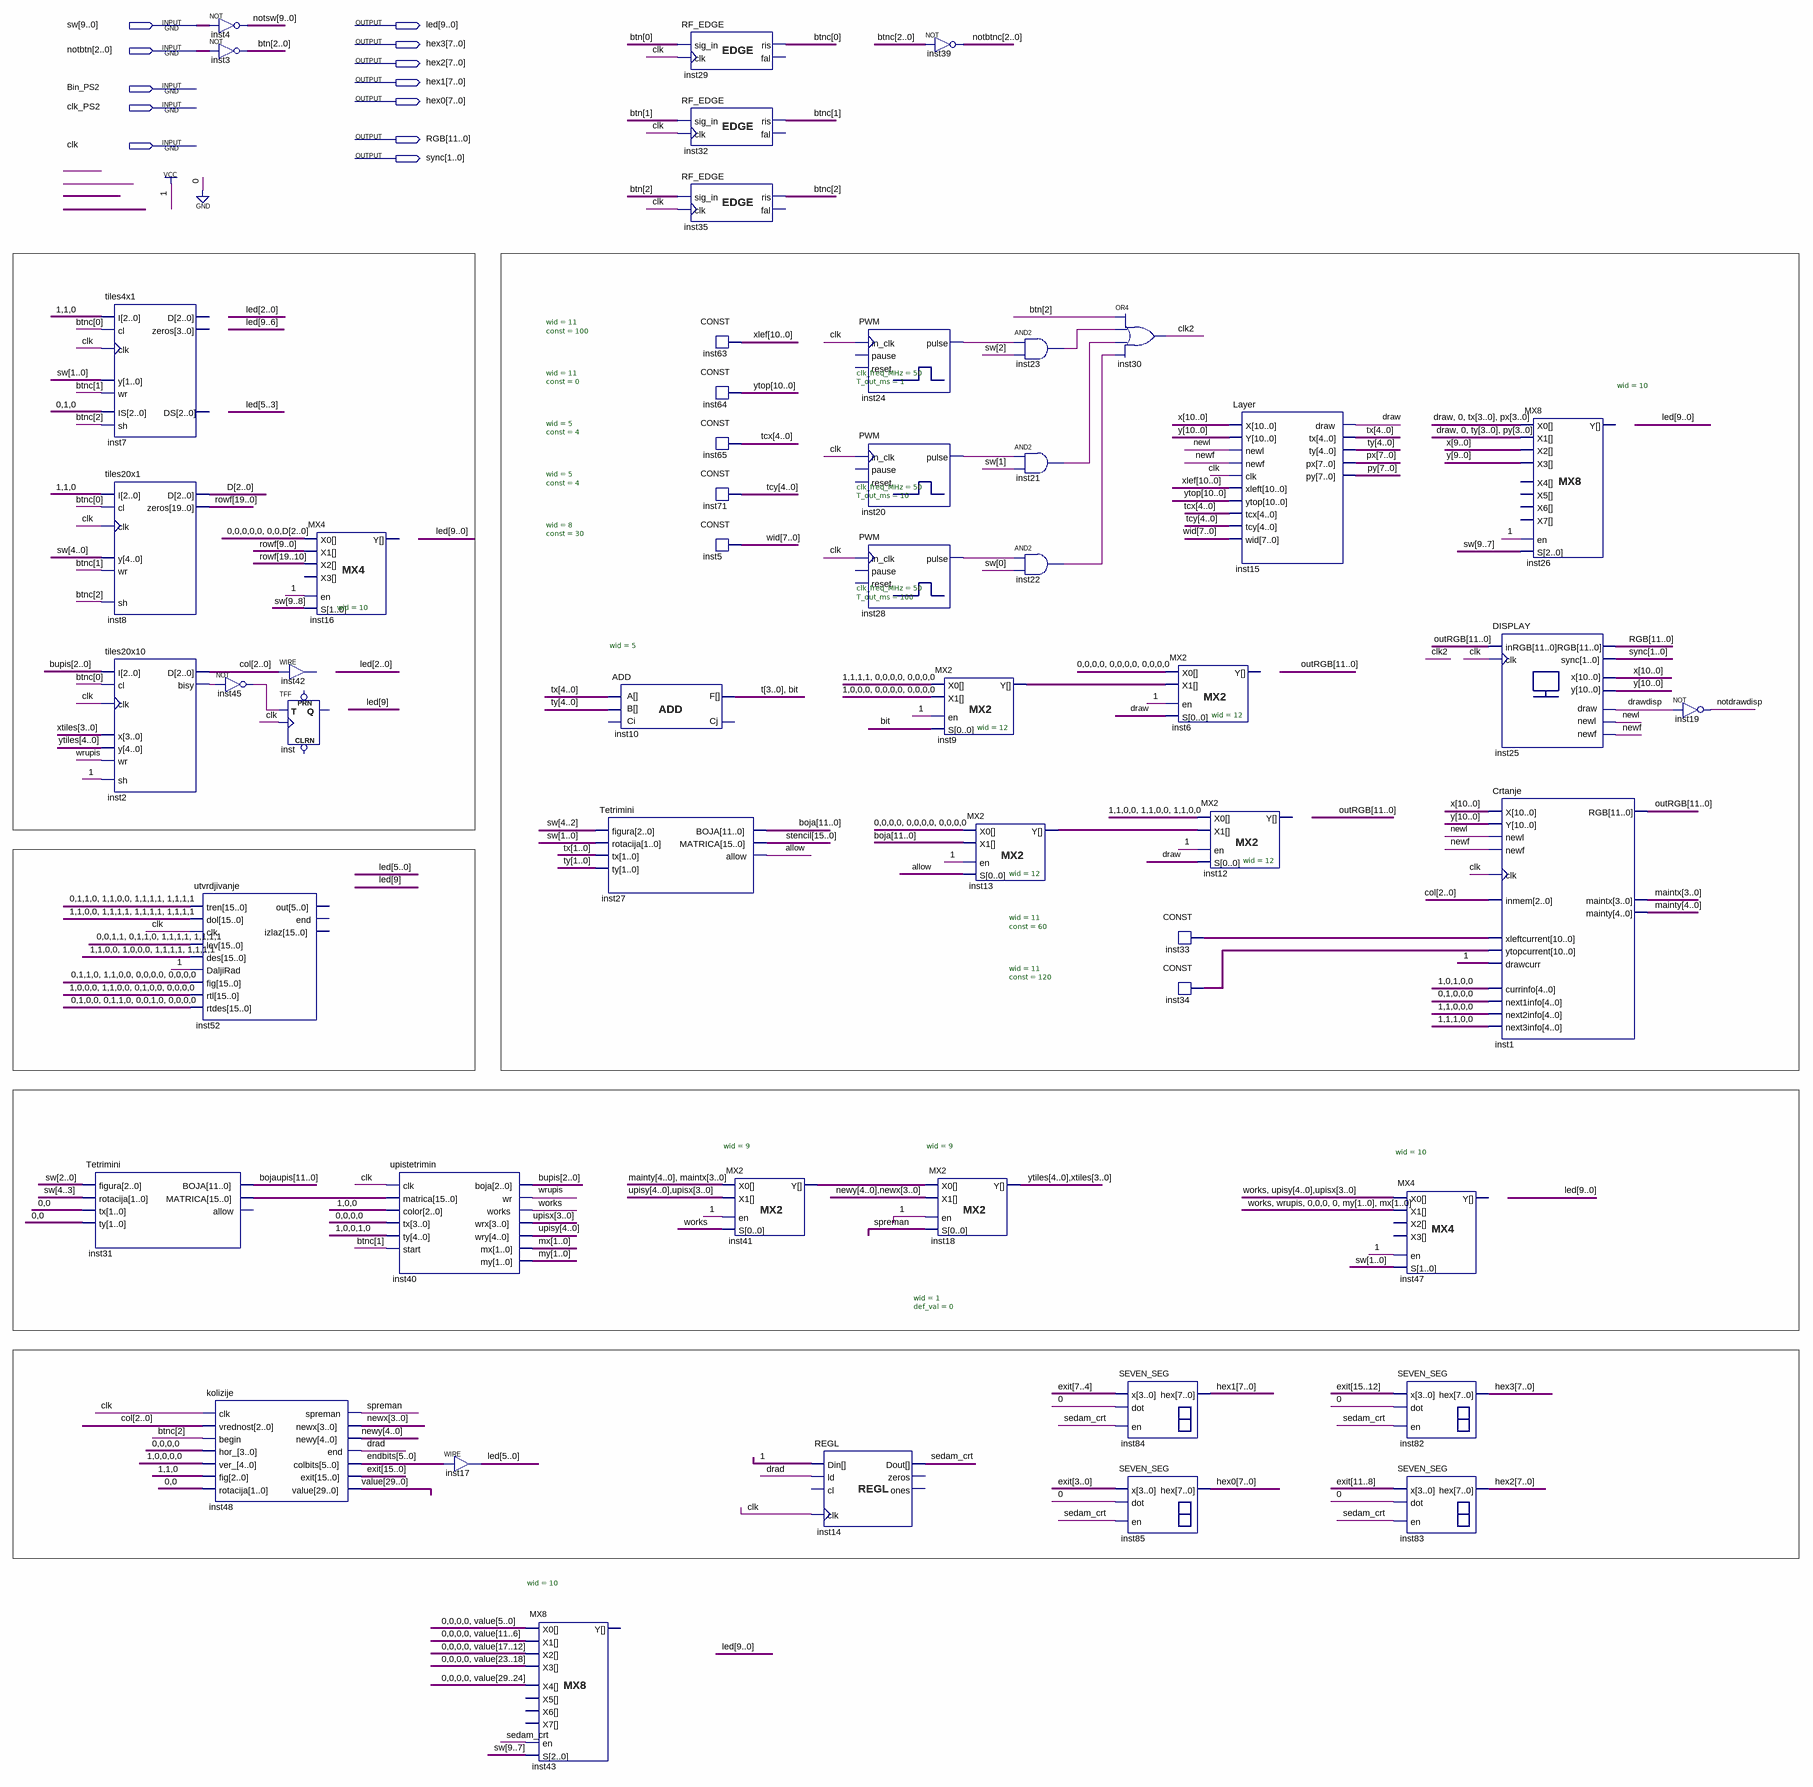
[diagram p0: schematic sheet]
// Quartus schematic test_modules.bdf as structural Verilog: 52 symbols, 12 pins
module test_modules (
  input  [9:0] sw,
  input  [2:0] notbtn,
  input  Bin_PS2,
  input  clk_PS2,
  input  clk,
  output [9:0] led,
  output [7:0] hex3,
  output [7:0] hex2,
  output [7:0] hex1,
  output [7:0] hex0,
  output [11:0] RGB,
  output [1:0] sync
);

  wire allow, \bit , clk2, drad, draw, drawdisp, inst2_bisy, inst20_pulse, inst21_out, inst22_out,
       inst23_out, inst24_pulse, inst28_pulse, inst45_out, newf, newl, notdrawdisp, sedam_crt, spreman,
       works, wrupis;
  wire [1:0] mx, my;
  wire [2:0] btn, btnc, bupis, col, D, notbtnc;
  wire [3:0] maintx, newx, t, upisx, xtiles;
  wire [4:0] mainty, newy, tcx, tcy, tx, ty, upisy, ytiles;
  wire [5:0] endbits;
  wire [7:0] px, py, wid;
  wire [8:0] inst41_y;
  wire [9:0] notsw;
  wire [10:0] inst33_data, inst34_data, x, xlef, y, ytop;
  wire [11:0] boja, bojaupis, inst9_y, inst13_y, outRGB;
  wire [15:0] exit, inst31_matrica, stencil;
  wire [19:0] rowf;
  wire [29:0] value;

  Tetrimini inst31 (
    .figura(sw[2:0]), .rotacija(sw[4:3]), .tx(2'b00), .ty(2'b00), .BOJA(bojaupis), .MATRICA(inst31_matrica));  // open: allow
  tiles4x1 inst7 (
    .I(3'b110), .cl(btnc[0]), .clk(clk), .y(sw[1:0]), .wr(btnc[1]), .IS(3'b010), .sh(btnc[2]));  // open: D, zeros, DS
  tiles20x1 inst8 (.I(3'b110), .cl(btnc[0]), .clk(clk), .y(sw[4:0]), .wr(btnc[1]), .sh(btnc[2]), .D(D), .zeros(rowf));
  tiles20x10 inst2 (
    .I(bupis), .cl(btnc[0]), .clk(clk), .x(xtiles), .y(ytiles), .wr(wrupis), .sh(1'b1), .D(col),
    .bisy(inst2_bisy));
  assign notsw = ~sw;  // NOT inst4, 10 bits wide
  assign btn = ~notbtn;  // NOT inst3, 3 bits wide
  not inst45 (inst45_out, inst2_bisy);
  utvrdjivanje inst52 (
    .tren(16'b0110110011111111), .dol(16'b1100111111111111), .clk(clk), .lev(16'b0011011011111111),
    .des(16'b1100100011111111), .DaljiRad(1'b1), .fig(16'b0110110000000000), .rtl(16'b1000110001000000),
    .rtdes(16'b0100011000100000));  // open: out, end, izlaz
  kolizije inst48 (
    .clk(clk), .vrednost(col), .\begin (btnc[2]), .hor_(4'b0000), .ver_(5'b10000), .fig(3'b110),
    .rotacija(2'b00), .spreman(spreman), .newx(newx), .newy(newy), .\end (drad), .colbits(endbits),
    .exit(exit), .value(value));
  // WIRE inst42 has open pins
  TFF inst (.T(inst45_out), .CLK(clk));  // open: PRN, CLRN, Q
  MX4 #(.wid(10)) inst16 (
    .X0({{7{1'b0}}, D}), .X1(rowf[9:0]), .X2(rowf[19:10]), .en(1'b1), .S(sw[9:8]));  // open: X3, Y
  upistetrimin inst40 (
    .clk(clk), .matrica(inst31_matrica), .color(3'b100), .tx(4'b0000), .ty(5'b10010), .start(btnc[1]),
    .boja(bupis), .wr(wrupis), .works(works), .wrx(upisx), .wry(upisy), .mx(mx), .my(my));
  assign led[5:0] = endbits;  // WIRE inst17
  MX8 #(.wid(10)) inst43 (
    .X0({4'b0000, value[5:0]}), .X1({4'b0000, value[11:6]}), .X2({4'b0000, value[17:12]}),
    .X3({4'b0000, value[23:18]}), .X4({4'b0000, value[29:24]}), .en(sedam_crt), .S(sw[9:7]));  // open: X5, X6, X7, Y
  ADD #(.wid(5)) inst10 (.A(tx), .B(ty), .F({t, \bit }));  // open: Ci, Cj
  Tetrimini inst27 (
    .figura(sw[4:2]), .rotacija(sw[1:0]), .tx(tx[1:0]), .ty(ty[1:0]), .BOJA(boja), .MATRICA(stencil),
    .allow(allow));
  RF_EDGE inst29 (.sig_in(btn[0]), .clk(clk), .ris(btnc[0]));  // open: fal
  RF_EDGE inst32 (.sig_in(btn[1]), .clk(clk), .ris(btnc[1]));  // open: fal
  RF_EDGE inst35 (.sig_in(btn[2]), .clk(clk), .ris(btnc[2]));  // open: fal
  CONST #(.wid(11), .\const (100)) inst63 (.data(xlef));
  CONST #(.wid(11), .\const (0)) inst64 (.data(ytop));
  CONST #(.wid(5), .\const (4)) inst65 (.data(tcx));
  CONST #(.wid(5), .\const (4)) inst71 (.data(tcy));
  CONST #(.wid(8), .\const (30)) inst5 (.data(wid));
  MX2 #(.wid(9)) inst41 (.X0({mainty, maintx}), .X1({upisy, upisx}), .en(1'b1), .S(works), .Y(inst41_y));
  REGL #(.wid(1), .def_val(0)) inst14 (.Din(1'b1), .ld(drad), .clk(clk), .Dout(sedam_crt));  // open: cl, zeros, ones
  PWM #(.clk_freq_MHz(50), .T_out_ms(1)) inst24 (.in_clk(clk), .pulse(inst24_pulse));  // open: pause, reset
  PWM #(.clk_freq_MHz(50), .T_out_ms(10)) inst20 (.in_clk(clk), .pulse(inst20_pulse));  // open: pause, reset
  PWM #(.clk_freq_MHz(50), .T_out_ms(100)) inst28 (.in_clk(clk), .pulse(inst28_pulse));  // open: pause, reset
  assign notbtnc = ~btnc;  // NOT inst39, 3 bits wide
  MX2 #(.wid(12)) inst9 (.X0(12'b111100000000), .X1(12'b100000000000), .en(1'b1), .S(\bit ), .Y(inst9_y));
  MX2 #(.wid(9)) inst18 (.X0(inst41_y), .X1({newy, newx}), .en(1'b1), .S(spreman), .Y({ytiles, xtiles}));
  MX2 #(.wid(12)) inst13 (.X0({12{1'b0}}), .X1(boja), .en(1'b1), .S(allow), .Y(inst13_y));
  and inst23 (inst23_out, inst24_pulse, sw[2]);
  and inst21 (inst21_out, inst20_pulse, sw[1]);
  and inst22 (inst22_out, inst28_pulse, sw[0]);
  or inst30 (clk2, btn[2], inst23_out, inst21_out, inst22_out);
  SEVEN_SEG inst84 (.x(exit[7:4]), .dot(1'b0), .en(sedam_crt), .hex(hex1));
  SEVEN_SEG inst85 (.x(exit[3:0]), .dot(1'b0), .en(sedam_crt), .hex(hex0));
  MX2 #(.wid(12)) inst6 (.X0({12{1'b0}}), .X1(inst9_y), .en(1'b1), .S(draw));  // open: Y
  MX2 #(.wid(12)) inst12 (.X0(12'b110011001100), .X1(inst13_y), .en(1'b1), .S(draw));  // open: Y
  CONST #(.wid(11), .\const (60)) inst33 (.data(inst33_data));
  CONST #(.wid(11), .\const (120)) inst34 (.data(inst34_data));
  Layer inst15 (
    .X(x), .Y(y), .newl(newl), .newf(newf), .clk(clk), .xleft(xlef), .ytop(ytop), .tcx(tcx), .tcy(tcy),
    .wid(wid), .draw(draw), .tx(tx), .ty(ty), .px(px), .py(py));
  MX4 #(.wid(10)) inst47 (
    .X0({works, upisy, upisx}), .X1({works, wrupis, 4'b0000, my, mx}), .en(1'b1), .S(sw[1:0]));  // open: X2, X3, Y
  SEVEN_SEG inst82 (.x(exit[15:12]), .dot(1'b0), .en(sedam_crt), .hex(hex3));
  SEVEN_SEG inst83 (.x(exit[11:8]), .dot(1'b0), .en(sedam_crt), .hex(hex2));
  DISPLAY inst25 (
    .inRGB(outRGB), .clk(clk), .RGB(RGB), .sync(sync), .x(x), .y(y), .draw(drawdisp), .newl(newl), .newf(newf));
  Crtanje inst1 (
    .X(x), .Y(y), .newl(newl), .newf(newf), .clk(clk), .inmem(col), .xleftcurrent(inst33_data),
    .ytopcurrent(inst34_data), .drawcurr(1'b1), .currinfo(5'b10100), .next1info(5'b01000),
    .next2info(5'b11000), .next3info(5'b11100), .RGB(outRGB), .maintx(maintx), .mainty(mainty));
  MX8 #(.wid(10)) inst26 (
    .X0({draw, 1'b0, tx[3:0], px[3:0]}), .X1({draw, 1'b0, ty[3:0], py[3:0]}), .X2(x[9:0]), .X3(y[9:0]),
    .en(1'b1), .S(sw[9:7]));  // open: X4, X5, X6, X7, Y
  not inst19 (notdrawdisp, drawdisp);
endmodule
